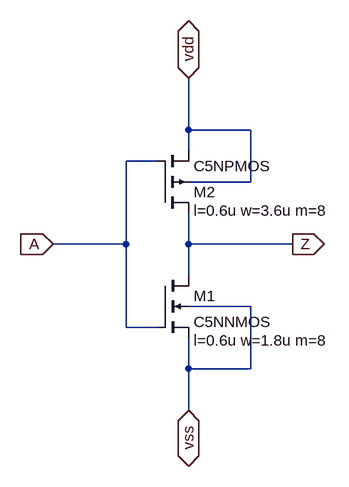
[diagram p0: schematic inv_8x.asc]
inv_8x.asc, the LTspice schematic file:
Version 4
SHEET 1 880 680
WIRE 208 -32 208 -112
WIRE 304 -32 208 -32
WIRE 208 0 208 -32
WIRE 160 16 112 16
WIRE 304 48 304 -32
WIRE 304 48 208 48
WIRE 112 144 112 16
WIRE 112 144 0 144
WIRE 208 144 208 96
WIRE 368 144 208 144
WIRE 208 192 208 144
WIRE 304 240 208 240
WIRE 112 272 112 144
WIRE 160 272 112 272
WIRE 208 336 208 288
WIRE 304 336 304 240
WIRE 304 336 208 336
WIRE 208 400 208 336
FLAG 0 144 A
IOPIN 0 144 In
FLAG 368 144 Z
IOPIN 368 144 Out
FLAG 208 -112 vdd
IOPIN 208 -112 BiDir
FLAG 208 400 vss
IOPIN 208 400 BiDir
SYMBOL nmos4 160 192 R0
WINDOW 123 56 100 Left 2
SYMATTR Value2 l=0.6u w=1.8u m=8
SYMATTR InstName M1
SYMATTR Value C5NNMOS
SYMBOL pmos4 160 96 M180
WINDOW 123 56 4 Left 2
SYMATTR Value2 l=0.6u w=3.6u m=8
SYMATTR InstName M2
SYMATTR Value C5NPMOS

The netlist it stands for:
* inv_8x.asc
M1 Z A vss vss C5NNMOS l=0.6u w=1.8u m=8
M2 Z A vdd vdd C5NPMOS l=0.6u w=3.6u m=8
.model NMOS NMOS
.model PMOS PMOS
.lib standard.mos
.backanno
.end